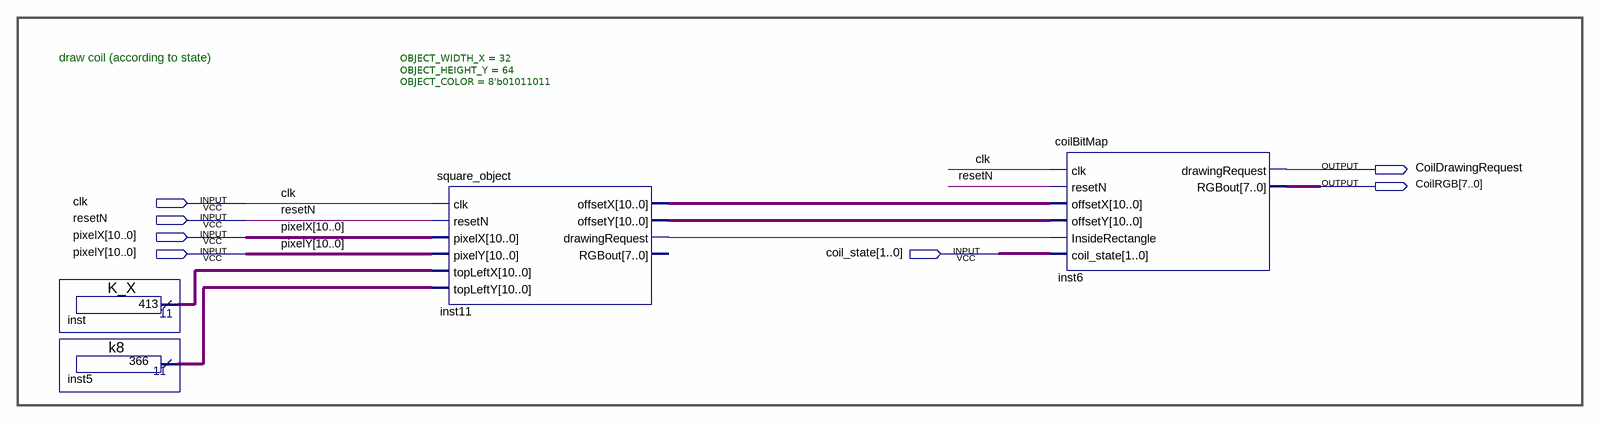
[diagram p0: schematic sheet]
// Quartus schematic coil_display.bdf as structural Verilog: 4 symbols, 7 pins
module coil_display (
  input  clk,
  input  resetN,
  input  [10:0] pixelX,
  input  [10:0] pixelY,
  input  [1:0] coil_state,
  output CoilDrawingRequest,
  output [7:0] CoilRGB
);

  wire inst11_drawingrequest;
  wire [10:0] inst5_result, inst11_offsetx, inst11_offsety, inst_result;

  K_X inst (.result(inst_result));
  k8 inst5 (.result(inst5_result));
  square_object #(.OBJECT_WIDTH_X(32), .OBJECT_HEIGHT_Y(64), .OBJECT_COLOR(8'b01011011)) inst11 (
    .clk(clk), .resetN(resetN), .pixelX(pixelX), .pixelY(pixelY), .topLeftX(inst_result),
    .topLeftY(inst5_result), .offsetX(inst11_offsetx), .offsetY(inst11_offsety),
    .drawingRequest(inst11_drawingrequest));  // open: RGBout
  coilBitMap inst6 (
    .clk(clk), .resetN(resetN), .offsetX(inst11_offsetx), .offsetY(inst11_offsety),
    .InsideRectangle(inst11_drawingrequest), .coil_state(coil_state), .drawingRequest(CoilDrawingRequest),
    .RGBout(CoilRGB));

  // Notes on the sheet:
  //   draw coil (according to state)
endmodule
